# EAGLE design MIDI_CV_0.222 (EAGLE 6.1)
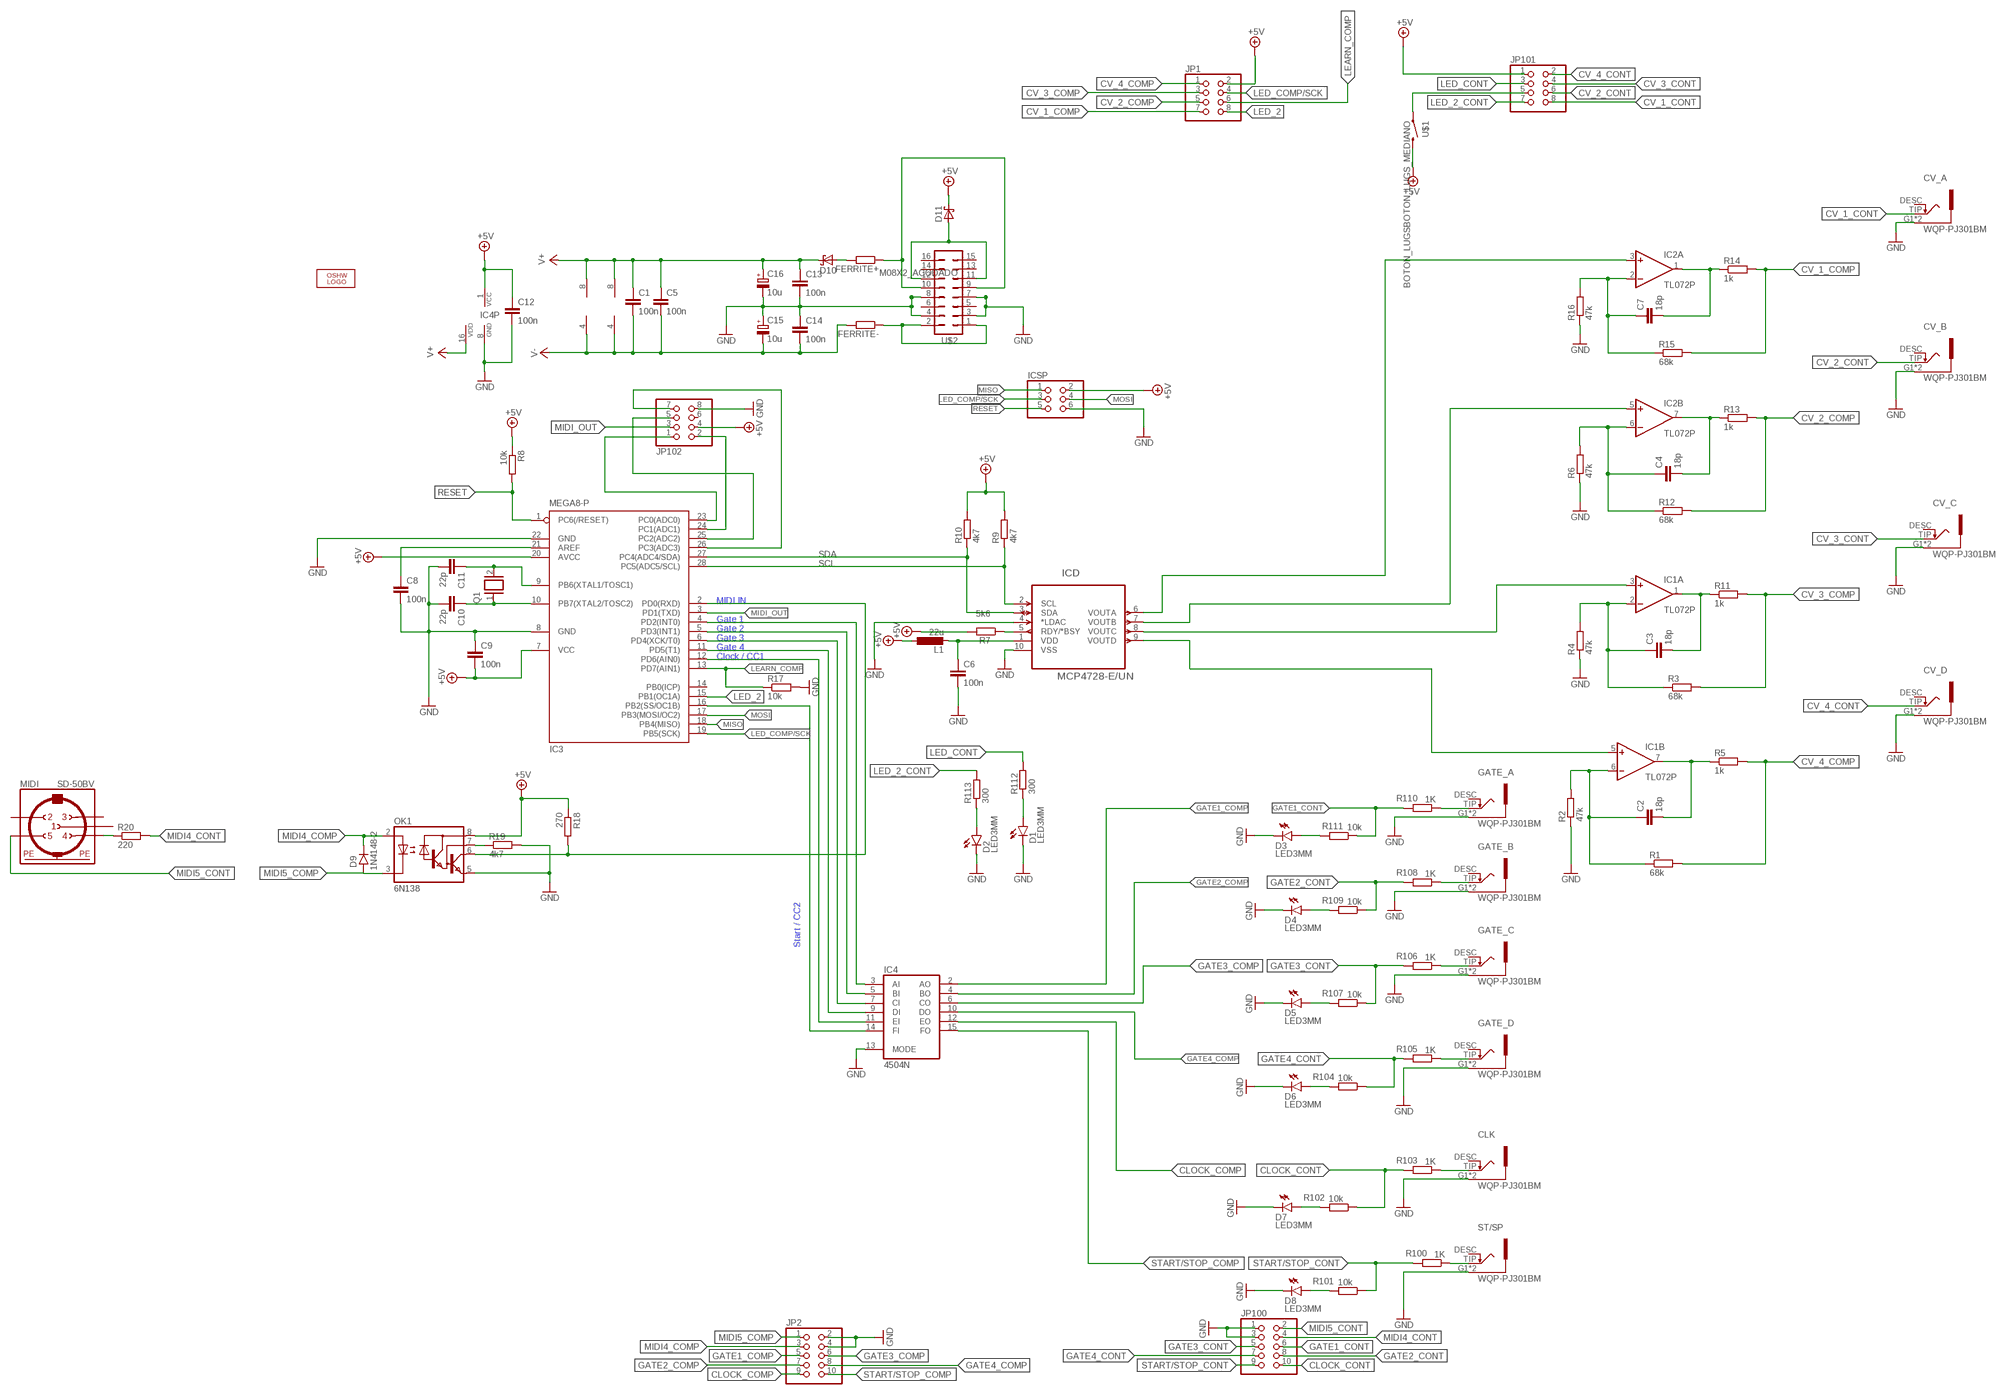
[diagram p0: schematic, sheet 1]

## Parts
$1_35_$  OSHW_LOGO_FILLX0200-NT  [OSHW_FILLX200_NOTEXT]
C1  100n  C-EU050-025X075  [C050-025X075]
C2  18p  C-EU050-025X075  [C050-025X075]
C3  18p  C-EU050-025X075  [C050-025X075]
C4  18p  C-EU050-025X075  [C050-025X075]
C5  100n  C-EU050-025X075  [C050-025X075]
C6  100n  C-EU050-025X075  [C050-025X075]
C7  18p  C-EU050-025X075  [C050-025X075]
C8  100n  C-EU050-025X075  [C050-025X075]
C9  100n  C-EU050-025X075  [C050-025X075]
C10  22p  C-EU050-025X075  [C050-025X075]
C11  22p  C-EU050-025X075  [C050-025X075]
C12  100n  C-EU050-025X075  [C050-025X075]
C13  100n  C-EU050-025X075  [C050-025X075]
C14  100n  C-EU050-025X075  [C050-025X075]
C15  10u  CPOL-EUE2-4  [E2-4]
C16  10u  CPOL-EUE2-4  [E2-4]
CLK  WQP-PJ301BM  [WQP-PJ301BM]
CV_A  WQP-PJ301BM  [WQP-PJ301BM]
CV_B  WQP-PJ301BM  [WQP-PJ301BM]
CV_C  WQP-PJ301BM  [WQP-PJ301BM]
CV_D  WQP-PJ301BM  [WQP-PJ301BM]
D1  LED3MM  [LED3MM]
D2  LED3MM  [LED3MM]
D3  LED3MM  [LED3MM]
D4  LED3MM  [LED3MM]
D5  LED3MM  [LED3MM]
D6  LED3MM  [LED3MM]
D7  LED3MM  [LED3MM]
D8  LED3MM  [LED3MM]
D9  1N4148-2  [DO35-2]
D10  SCHOTTKY-DIODEDO35-7  [DO35-7]
D11  SCHOTTKY-DIODEDO35-7  [DO35-7]
FERRITE+  R-EU_0204/5  [0204/5]
FERRITE-  R-EU_0204/5  [0204/5]
GATE_A  WQP-PJ301BM  [WQP-PJ301BM]
GATE_B  WQP-PJ301BM  [WQP-PJ301BM]
GATE_C  WQP-PJ301BM  [WQP-PJ301BM]
GATE_D  WQP-PJ301BM  [WQP-PJ301BM]
IC1  TL072P  [DIL08]
IC2  TL072P  [DIL08]
IC3  MEGA8-P  [DIL28-3]
IC4  4504N  [DIL16]
ICD  MCP4728-E/UN  [SOP50P490X110-10N]
ICSP  PINHD-2X3  [2X03]
JP1  PINHD-2X4  [2X04]
JP2  PINHD-2X5  [2X05]
JP100  PINHD-2X5  [2X05]
JP101  PINHD-2X4  [2X04]
JP102  PINHD-2X4  [2X04]
L1  22u  L-EU0204/7  [0204/7]
MIDI  SD-50BV  [SD-50BV]
OK1  6N138  [DIL08]
Q1  XTAL/S  [QS]
R1  68k  R-EU_0204/5  [0204/5]
R2  47k  R-EU_0204/5  [0204/5]
R3  68k  R-EU_0204/5  [0204/5]
R4  47k  R-EU_0204/5  [0204/5]
R5  1k  R-EU_0204/5  [0204/5]
R6  47k  R-EU_0204/5  [0204/5]
R7  5k6  R-EU_0204/5  [0204/5]
R8  10k  R-EU_0204/5  [0204/5]
R9  4k7  R-EU_0204/5  [0204/5]
R10  4k7  R-EU_0204/5  [0204/5]
R11  1k  R-EU_0204/5  [0204/5]
R12  68k  R-EU_0204/5  [0204/5]
R13  1k  R-EU_0204/5  [0204/5]
R14  1k  R-EU_0204/5  [0204/5]
R15  68k  R-EU_0204/5  [0204/5]
R16  47k  R-EU_0204/5  [0204/5]
R17  10k  R-EU_0204/5  [0204/5]
R18  270  R-EU_0204/5  [0204/5]
R19  4k7  R-EU_0204/5  [0204/5]
R20  220  R-EU_0204/5  [0204/5]
R100  1K  R-EU_0204/5  [0204/5]
R101  10k  R-EU_0204/5  [0204/5]
R102  10k  R-EU_0204/5  [0204/5]
R103  1K  R-EU_0204/5  [0204/5]
R104  10k  R-EU_0204/5  [0204/5]
R105  1K  R-EU_0204/5  [0204/5]
R106  1K  R-EU_0204/5  [0204/5]
R107  10k  R-EU_0204/5  [0204/5]
R108  1K  R-EU_0204/5  [0204/5]
R109  10k  R-EU_0204/5  [0204/5]
R110  1K  R-EU_0204/5  [0204/5]
R111  10k  R-EU_0204/5  [0204/5]
R112  300  R-EU_0204/5  [0204/5]
R113  300  R-EU_0204/5  [0204/5]
ST/SP  WQP-PJ301BM  [WQP-PJ301BM]
U$1  BOTON_LUGSBOTON_LUGS_MEDIANO  [BOTON_LUGS_MEDIANO]
U$2  M08X2_ACODADO  [2X8-POWER-ACODADO]

## Nets
+5V: C9.2 C12.1 D11.C IC3.7(VCC) IC3.20(AVCC) IC4.1(VCC) ICSP.2 JP1.2 JP101.1 JP102.4 L1.1 OK1.8(VCC) R7.2 R8.1 R9.2 R10.2 R18.1 U$1.P$2
A: IC2.3(A:+IN) ICD.6(VOUTA)
B: IC2.5(B:+IN) ICD.7(VOUTB)
C: IC1.3(A:+IN) ICD.8(VOUTC)
CLOCK_COMP: IC4.12(EO) JP2.9
CLOCK_CONT: JP100.10 R102.1 R103.2
CV_1_COMP: JP1.7 R14.2 R15.2
CV_1_CONT: CV_A.TIP JP101.8
CV_2_COMP: JP1.5 R12.2 R13.2
CV_2_CONT: CV_B.TIP JP101.6
CV_3_COMP: JP1.3 R3.2 R11.2
CV_3_CONT: CV_C.TIP JP101.4
CV_4_COMP: JP1.1 R1.2 R5.2
CV_4_CONT: CV_D.TIP JP101.2
D: IC1.5(B:+IN) ICD.9(VOUTD)
DAC_A_FEEDBACK_T: C7.2 IC2.1(A:OUT) R14.1
GATE1_COMP: IC4.2(AO) JP2.5
GATE1_CONT: JP100.6 R110.2 R111.1
GATE2_COMP: IC4.4(BO) JP2.7
GATE2_CONT: JP100.8 R108.2 R109.1
GATE3_COMP: IC4.6(CO) JP2.6
GATE3_CONT: JP100.5 R106.2 R107.1
GATE4_COMP: IC4.10(DO) JP2.8
GATE4_CONT: JP100.7 R104.1 R105.2
GND: C6.2 C8.2 C9.1 C10.2 C11.2 C12.2 C13.2 C14.1 C15.+ C16.- CLK.G1(SLEVE) CLK.G2(SLEVE) CV_A.G1(SLEVE) CV_A.G2(SLEVE) CV_B.G1(SLEVE) CV_B.G2(SLEVE) CV_C.G1(SLEVE) CV_C.G2(SLEVE) CV_D.G1(SLEVE) CV_D.G2(SLEVE) D1.K(C) D2.K(C) D3.K(C) D4.K(C) D5.K(C) D6.K(C) D7.K(C) D8.K(C) GATE_A.G1(SLEVE) GATE_A.G2(SLEVE) GATE_B.G1(SLEVE) GATE_B.G2(SLEVE) GATE_C.G1(SLEVE) GATE_C.G2(SLEVE) GATE_D.G1(SLEVE) GATE_D.G2(SLEVE) IC3.8(GND) IC3.22(GND) IC4.8(GND) IC4.13(MODE) ICD.4(*LDAC) ICD.10(VSS) ICSP.6 JP2.2 JP2.4 JP100.1 JP100.3 JP102.8 OK1.5(GND) R2.1 R4.1 R6.1 R16.1 R17.2 R19.2 ST/SP.G1(SLEVE) ST/SP.G2(SLEVE) U$2.3 U$2.4 U$2.7 U$2.8
LEARN_COMP: IC3.13(PD7(AIN1)) JP1.6 R17.1
LED_2: IC3.15(PB1(OC1A)) JP1.8
LED_2_CONT: JP101.7 R113.2
LED_COMP/SCK: IC3.19(PB5(SCK)) ICSP.3 JP1.4
LED_CONT: JP101.3 R112.2
MIDI4_COMP: D9.C JP2.3 OK1.2(A)
MIDI4_CONT: JP100.4 R20.2
MIDI5_COMP: D9.A JP2.1 OK1.3(C)
MIDI5_CONT: JP100.2 MIDI.5
MIDI_OUT: IC3.3(PD1(TXD)) JP102.3
MISO: IC3.18(PB4(MISO)) ICSP.1
MOSI: IC3.17(PB3(MOSI/OC2)) ICSP.4
N$1: D7.A R102.2
N$2: C10.1 IC3.10(PB7(XTAL2/TOSC2)) Q1.1
N$3: FERRITE-.1 U$2.1 U$2.2
N$4: IC3.23(PC0(ADC0)) JP102.1
N$5: C4.2 IC2.7(B:OUT) R13.1
N$6: C2.1 IC1.6(B:-IN) R1.1 R2.2
N$7: D1.A R112.1
N$8: JP101.5 U$1.P$1
N$9: IC3.16(PB2(SS/OC1B)) IC4.14(FI)
N$10: C3.2 IC1.1(A:OUT) R11.1
N$11: C7.1 IC2.2(A:-IN) R15.1 R16.2
N$12: IC3.24(PC1(ADC1)) JP102.2
N$13: R100.1 ST/SP.TIP
N$14: IC3.25(PC2(ADC2)) JP102.5
N$15: C3.1 IC1.2(A:-IN) R3.1 R4.2
N$16: CLK.TIP R103.1
N$17: GATE_D.TIP R105.1
N$18: ICD.5(RDY/*BSY) R7.1
N$19: IC3.5(PD3(INT1)) IC4.5(BI)
N$20: IC3.26(PC3(ADC3)) JP102.7
N$21: C2.2 IC1.7(B:OUT) R5.1
N$23: D11.A U$2.11 U$2.12
N$24: IC3.11(PD5(T1)) IC4.9(DI)
N$25: D10.A FERRITE+.2
N$26: D2.A R113.1
N$27: GATE_A.TIP R110.1
N$28: C6.1 ICD.1(VDD) L1.2
N$29: C11.1 IC3.9(PB6(XTAL1/TOSC1)) Q1.2
N$30: IC3.12(PD6(AIN0)) IC4.11(EI)
N$31: FERRITE+.1 U$2.9 U$2.10
N$32: D3.A R111.2
N$33: D8.A R101.2
N$34: GATE_B.TIP R108.1
N$35: IC3.4(PD2(INT0)) IC4.3(AI)
N$36: GATE_C.TIP R106.1
N$37: D4.A R109.2
N$38: IC3.6(PD4(XCK/T0)) IC4.7(CI)
N$39: MIDI.4 R20.1
N$41: C8.1 IC3.21(AREF)
N$42: D5.A R107.2
N$44: D6.A R104.2
N$46: OK1.7(VB) R19.1
N$56: IC3.2(PD0(RXD)) OK1.6(VO) R18.2
N$60: C4.1 IC2.6(B:-IN) R6.2 R12.1
RESET: IC3.1(PC6(/RESET)) ICSP.5 R8.2
SCL_B: IC3.28(PC5(ADC5/SCL)) ICD.2(SCL) R9.1
SDA_T: IC3.27(PC4(ADC4/SDA)) ICD.3(SDA) R10.1
START/STOP_COMP: IC4.15(FO) JP2.10
START/STOP_CONT: JP100.9 R100.2 R101.1
V+: C1.1 C5.1 C13.1 C16.+ D10.C IC1.8(P:V+) IC2.8(P:V+) IC4.16(VDD)
V-: C1.2 C5.2 C14.2 C15.- FERRITE-.2 IC1.4(P:V-) IC2.4(P:V-)
Unconnected: CLK.DESC(SWITCH) CV_A.DESC(SWITCH) CV_B.DESC(SWITCH) CV_C.DESC(SWITCH) CV_D.DESC(SWITCH) GATE_A.DESC(SWITCH) GATE_B.DESC(SWITCH) GATE_C.DESC(SWITCH) GATE_D.DESC(SWITCH) IC3.14(PB0(ICP)) JP102.6 MIDI.1 MIDI.2 MIDI.3 ST/SP.DESC(SWITCH) U$2.5 U$2.6 U$2.13 U$2.14 U$2.15 U$2.16

## Notes on the sheet
- SDA
- SCL
- MIDI IN
- Gate 1
- Gate 2
- Gate 3
- Gate 4
- Clock / CC1
- Start / CC2

## Library data of the parts
$1_35_$ = ohw-logo:OSHW_LOGO_FILL
C1-C14 = rcl:C-EU: CAPACITOR, European symbol
C15 C16 = rcl:CPOL-EU: POLARIZED CAPACITOR, European symbol
CLK CV_A CV_B CV_C CV_D GATE_A GATE_B GATE_C GATE_D ST/SP = minijack_3_5_quingpu:WQP-PJ301BM
D1-D8 = gm-diodes:LED
D9 = gm-diodes:1N4148: Fast Switching Diode DO-35 glass case a.k.a. 1N914
D10 D11 = diode:SCHOTTKY-DIODE: Schottky Diode
FERRITE+ FERRITE- R1-R20 R100-R113 = rcl:R-EU_: RESISTOR, European symbol
IC1 IC2 = linear:TL072: OP AMP
IC3 = atmel:MEGA8-P: MICROCONTROLLER 8 Kbytes FLASH, 1 kbytes SRAM, 512 bytes EEPROM, USART, 4-channel 10 bit ADC, 2-channel 8 bit ADC Pin compatible with Atmega48, ATMega88, ATMega168 Source: avr.lbr
IC4 = 45xx:4504: TTL or CMOS to CMOS hex LEVEL SHIFTER
ICD = MCP4728:MCP4728-E/UN: IC, DAC, 12BIT, QUAD; MPN: MCP4728-E/UN; OC_FARNELL: 1800217; OC_NEWARK: 08R1808; PACKAGE: MSOP-10; SUPPLIER: MICROCHIP
ICSP = pinhead:PINHD-2X3: PIN HEADER
JP1 JP101 JP102 = pinhead:PINHD-2X4: PIN HEADER
JP2 JP100 = pinhead:PINHD-2X5: PIN HEADER
L1 = rcl:L-EU: INDUCTOR, European symbol
MIDI = con-MIDI_PCB:SD-50BV
OK1 = optocoupler:6N138: MOTOROLA OPTO COUPLER
Q1 = special:XTAL/S: CRYSTAL
U$1 = boton_lugs:BOTON_LUGS
U$2 = SparkFun:M08X2_ACODADO

## Board
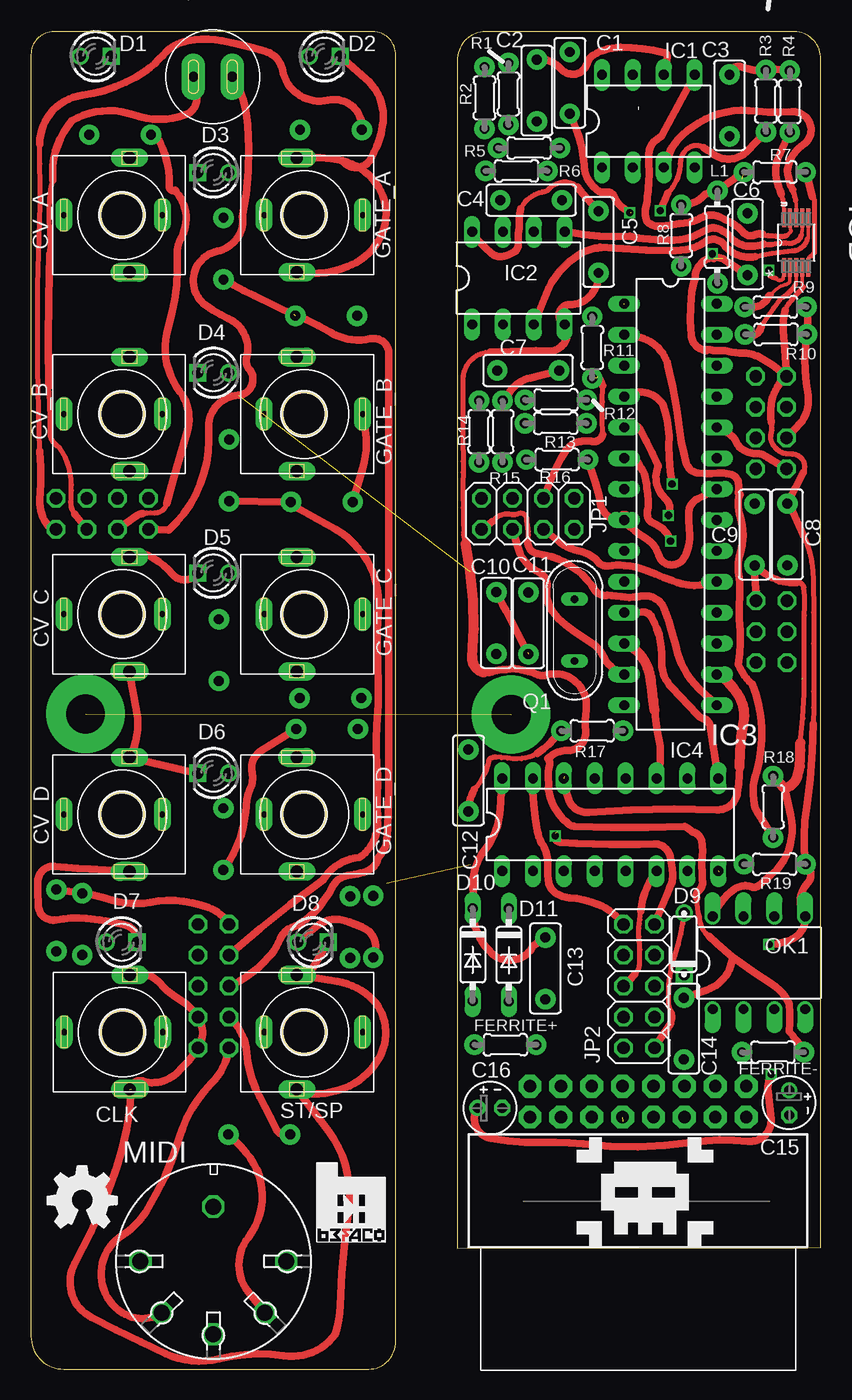
[diagram p1: board, top side]
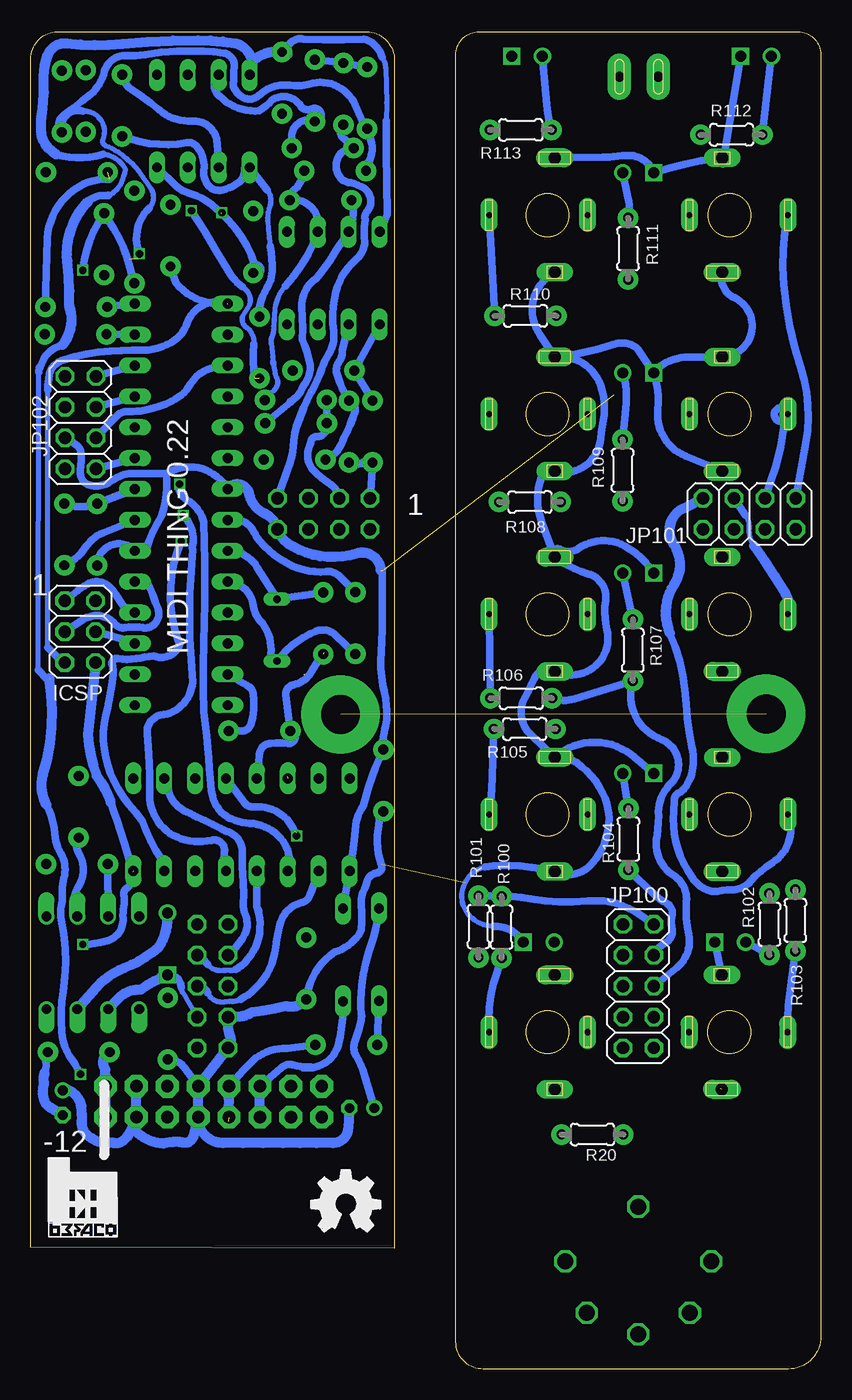
[diagram p2: board, bottom side, seen from below]

Size 64.95 x 110 mm. Coordinates in mm from the lower left corner, seen from the top.
Outline: 0,108.12 0,2.68 arc90 2.68,0 27.76,0 arc90 30,2.24 30,108.11 arc90 28.11,110 1.88,110 arc90 0,108.12
Outline: 35.05,9.95 64.95,10 64.95,107.77 arc90 62.77,110 37.36,110 arc90 35.05,107.64 35.05,9.95
Copper layers (1*16): Top 0.035mm / dielectric 1.5mm / Bottom 0.035mm
Design rules: minimum track width 6mil, minimum drill 12mil, track to track 6mil, track to pad 6mil, pad to pad 6mil, via to via 6mil, smd to smd 0mil, copper to edge 10mil, drill to drill 10mil, minimum pad ring 10mil, minimum via ring 6mil, stop-mask expansion 2mil, vias tented up to drill 100mil, thermal gap 10mil

### Footprints (pad centres in the part's own frame; a part is rotated, then mirrored left to right if it is on the bottom)
C050-025X075 = drill 0.813 pad 1.676: 1 -2.54,0; 2 2.54,0
E2-4 = drill 0.813 pad 1.27: + -1.016,0 | drill 0.813 pad 1.27 octagon: - 1.016,0
WQP-PJ301BM = drill 0.5 pad 1.4 long: DESC 0,-3.3; TIP 0,4.8 | drill 1 pad 1.2 long: G1 4.7,-0.6 | drill 1 pad 1.55 long: G2 -4.7,-0.6
LED3MM = drill 0.9: A -1.27,0 | drill 0.9 square: K 1.27,0
DO35-2 = drill 0.9: A 2.54,0 | drill 0.9 square: C -2.54,0
DO35-7 = drill 0.813 long: A 3.81,0; C -3.81,0
0204/5 = drill 0.813 pad 1.676: 1 -2.54,0; 2 2.54,0
DIL08 = drill 0.813 long: 1 -3.81,-3.81; 2 -1.27,-3.81; 3 1.27,-3.81; 4 3.81,-3.81; 5 3.81,3.81; 6 1.27,3.81; 7 -1.27,3.81; 8 -3.81,3.81
DIL28-3 = drill 0.813 long: 1 -16.51,-3.81; 2 -13.97,-3.81; 3 -11.43,-3.81; 4 -8.89,-3.81; 5 -6.35,-3.81; 6 -3.81,-3.81; 7 -1.27,-3.81; 8 1.27,-3.81; 9 3.81,-3.81; 10 6.35,-3.81; 11 8.89,-3.81; 12 11.43,-3.81; 13 13.97,-3.81; 14 16.51,-3.81; 15 16.51,3.81; 16 13.97,3.81; 17 11.43,3.81; 18 8.89,3.81; 19 6.35,3.81; 20 3.81,3.81; 21 1.27,3.81; 22 -1.27,3.81; 23 -3.81,3.81; 24 -6.35,3.81; 25 -8.89,3.81; 26 -11.43,3.81; 27 -13.97,3.81; 28 -16.51,3.81
DIL16 = drill 0.813 long: 1 -8.89,-3.81; 2 -6.35,-3.81; 3 -3.81,-3.81; 4 -1.27,-3.81; 5 1.27,-3.81; 6 3.81,-3.81; 7 6.35,-3.81; 8 8.89,-3.81; 9 8.89,3.81; 10 6.35,3.81; 11 3.81,3.81; 12 1.27,3.81; 13 -1.27,3.81; 14 -3.81,3.81; 15 -6.35,3.81; 16 -8.89,3.81
SOP50P490X110-10N = smd 1.524 x 0.33: 1 -2.032,0.991; 2 -2.032,0.508; 3 -2.032,0; 4 -2.032,-0.508; 5 -2.032,-0.991; 6 2.032,-0.991; 7 2.032,-0.508; 8 2.032,0; 9 2.032,0.508; 10 2.032,0.991
2X03 = drill 1.016 octagon: 1 -2.54,-1.27; 2 -2.54,1.27; 3 0,-1.27; 4 0,1.27; 5 2.54,-1.27; 6 2.54,1.27
2X04 = drill 1.016 octagon: 1 -3.81,-1.27; 2 -3.81,1.27; 3 -1.27,-1.27; 4 -1.27,1.27; 5 1.27,-1.27; 6 1.27,1.27; 7 3.81,-1.27; 8 3.81,1.27
2X05 = drill 1.016 octagon: 1 -5.08,-1.27; 2 -5.08,1.27; 3 -2.54,-1.27; 4 -2.54,1.27; 5 0,-1.27; 6 0,1.27; 7 2.54,-1.27; 8 2.54,1.27; 9 5.08,-1.27; 10 5.08,1.27
0204/7 = drill 0.813 pad 1.676: 1 -3.81,0; 2 3.81,0
SD-50BV = drill 1.321 octagon: 1 6,0; 2 0,-6; 3 -6,0; 4 4.24,-4.24; 5 -4.24,-4.24; PE 0,4.5
DIL08' = drill 0.813 offset: 1 -3.81,-3.81; 2 -1.27,-3.81; 3 1.27,-3.81; 4 3.81,-3.81; 5 3.81,3.81; 6 1.27,3.81; 7 -1.27,3.81; 8 -3.81,3.81
QS = drill 0.61 long: 1 -2.54,0; 2 2.54,0
BOTON_LUGS_MEDIANO = drill 0.8 pad 1.93 long: P$1 -1.6,0; P$2 1.6,0
2X8-POWER-ACODADO = drill 1.016 pad 1.88 octagon: 1 -1.27,7.62; 2 1.27,7.62; 3 -1.27,5.08; 4 1.27,5.08; 5 -1.27,2.54; 6 1.27,2.54; 7 -1.27,0; 8 1.27,0; 9 -1.27,-2.54; 10 1.27,-2.54; 11 -1.27,-5.08; 12 1.27,-5.08; 13 -1.27,-7.62; 14 1.27,-7.62; 15 -1.27,-10.16; 16 1.27,-10.16

### Placement (x,y rotation side)
$1_35_$  41.89,11.3 0 bottom
C1  44.3,105.8 270 top
C2  41.6,105.17 270 top
C3  57.44,103.95 270 top
C4  41.13,96.15 180 top
C5  46.67,92.71 270 top
C6  58.92,92.53 270 top
C7  40.89,82.14 180 top
C8  62.2,68.65 90 top
C9  59.5,68.64 270 top
C10  38.27,61.37 90 top
C11  40.91,61.35 270 top
C12  35.97,48.42 270 top
C13  42.3,32.96 270 top
C14  53.69,28.01 90 top
C15  62.34,21.91 270 top
C16  37.74,21.47 0 top
CLK  7.53,27.72 90 top
CV_A  7.5,94.93 90 top
CV_B  7.5,78.56 90 top
CV_C  7.5,62.09 90 top
CV_D  7.5,45.62 90 top
D1  5.32,108 0 top
D2  24.15,108 0 top
D3  15,98.41 180 top
D4  15,81.94 180 top
D5  15,65.48 180 top
D6  15,49.01 180 top
D7  7.45,35.12 0 top
D8  23.19,35.12 0 top
D9  53.71,34.97 90 top
D10  36.33,34.09 270 top
D11  39.29,34.07 270 top
FERRITE+  39.01,26.68 180 top
FERRITE-  61.01,26.07 0 top
GATE_A  22.47,94.93 270 top
GATE_B  22.47,78.56 270 top
GATE_C  22.47,62.09 270 top
GATE_D  22.47,45.62 270 top
IC1  50.77,102.65 0 top
IC2  40.08,89.74 0 top
IC3  52.58,71.12 270 top
IC4  47.63,44.78 0 top
ICD  62.91,92.66 90 top
ICSP  60.89,60.66 270 bottom
JP1  40.86,70.35 180 top
JP2  50,31.5 90 top
JP100  15,31.5 90 bottom
JP101  5.86,70.35 0 bottom
JP102  60.86,77.86 90 bottom
L1  56.44,93.12 270 top
LOGO1  OSHW_LOGO_FILLX0200-NT  [OSHW_FILLX200_NOTEXT]  1.38,11.64 0 top
MIDI  15,8.87 0 top
OK1  6N138  [DIL08']  59.86,33.42 0 top
Q1  44.71,60.78 90 top
R1  39.26,104.89 270 top
R2  37.3,104.56 90 top
R3  60.43,104.31 270 top
R4  62.39,104.27 90 top
R5  40.95,100.44 180 top
R6  39.93,98.56 0 top
R7  61.17,98.46 180 top
R8  53.47,93.24 270 top
R9  61.22,87.38 0 top
R10  61.27,85.12 0 top
R11  46.15,84.03 270 top
R12  43.16,79.72 180 top
R13  43.15,77.8 180 top
R14  36.85,77.12 270 top
R15  38.79,77.11 270 top
R16  43.26,74.81 180 top
R17  46.15,52.5 180 top
R18  61.03,46.25 270 top
R19  61.16,41.54 0 top
R20  18.78,19.3 180 bottom
R100  26.24,36.35 90 bottom
R101  28.14,36.39 270 bottom
R102  4.22,36.6 270 bottom
R103  2.09,36.91 90 bottom
R104  15.82,43.6 90 bottom
R105  24.34,52.66 0 bottom
R106  24.63,55.19 0 bottom
R107  15.45,59.14 90 bottom
R108  23.92,71.33 0 bottom
R109  16.29,73.93 90 bottom
R110  24.28,86.64 0 bottom
R111  15.83,92.17 90 bottom
R112  7.33,101.53 180 bottom
R113  24.67,101.93 180 bottom
ST/SP  22.47,27.72 270 top
U$1  14.96,106.31 0 top
U$2  51.19,21.99 270 top
U$3  LOGOBEFACOCONLETRAS  [LOGOBEFACOCONLETRAS_2]  26.09,13.12 0 top
U$4  [CALAVERA]  44.86,10.02 0 top
U$100  LOGOBEFACOCONLETRAS  [LOGOBEFACOCONLETRAS_2]  60.92,13.54 0 bottom

### Tracks (layer width: path | path; a pad name or v marks a point on that pad's centre or on a via)
+5V  (3 unrouted)
  Top 0.406: 63.28,51.53 arc9 63.57,57.59 arc0 63.59,62 arc11 63.56,64.29 arc84 62.96,64.72
  Top 0.61: 62.96,64.72 arc-28 61.31,64.93 arc-23 C9.2 arc8 59.7,63.23 arc-146 ICSP.2 | JP102.4 arc6 63.26,77.8 arc49 63.89,80.13 arc-19 R10.2 arc19 R9.2 | R7.2 L1.1 arc8 55.43,96.64 arc-56 R8.1 | JP101.1 11.35,69 arc51 14.61,77.31 arc-90 17.03,80.1 arc127 17.94,82.26 arc-56 17.73,83.22 arc81 16.24,86.4 arc-12 14.37,87.5 arc-132 15.32,91.96 arc51 17.16,93.37 arc34 17.41,94.82 arc-51 17.39,94.75 arc16 17.84,102.32 arc27 16.57,106.32 arc231 U$1.P$2 | 61.99,47.78 62.48,45.52 arc-54 61.33,41.07 arc3 59.83,39.77 arc-63 59.27,39.66 arc55 57.87,39.5 arc34 56.11,37.29 arc-100 56.05,37.27 arc230 OK1.8
  Top 0.813: R18.1 61.99,47.78 arc65 63.05,48.88 arc-4 63.22,49.6 arc1 63.28,51.53
  Bottom 0.61: IC3.7 arc-93 53.82,73.65 | 53.82,73.65 arc26 54.2,70.22 arc-13 55.47,67.43 arc94 IC3.20 arc-138 C9.2 | 53.82,73.65 56.48,73.65 arc-35 57.88,73.31 arc2 58.6,72.89 arc50 60.25,72.76 arc48 60.8,73.31 arc27 60.89,73.95 arc-3 60.8,75.09 arc-73 61.57,76.23 arc24 JP102.4 | R9.2 63.6,93 arc62 60.55,97.49 arc28 58.47,97.87 | C12.1 arc-11 37.61,46.33 arc-26 38.25,44.76 arc5 IC4.1 D11.C | 36.06,50.77 arc16 35.84,52.61 arc-20 35.71,54.58 arc-11 36.01,56.28 arc18 36.14,58.98 arc-5 36.07,64.43 arc5 36.05,65.66
  Bottom 0.813: C12.1 arc-29 36.06,50.77 | 36.16,65.65 arc-106 38.15,67.09 arc47 43.44,67.68 arc44 JP1.2 arc-51 45.6,70.31 arc55 47,72 arc-131 IC3.7
A
  Top 0.305: ICD.6 63.89,93 63.85,93
  Top 0.406: 59.58,91.52 arc-9 61.61,91.86 arc-5 62.58,91.99 arc78 63.85,93
  Top 0.61: IC2.3 42.38,88.43 arc-45 45.6,91.94 arc-24 46.87,92.24 arc12 46.79,92.28 arc3 52.5,91.99 arc16 54.33,92.2 arc22 55.38,92.7 arc-89 56.99,92.49 arc66 59.58,91.52
B
  Top 0.305: ICD.7 63.43,93.85 arc-10 63.34,93.3
  Top 0.406: 63.34,93.3 arc-49 63.01,92.79 arc-11 62.62,92.62 arc-26 62.33,92.58 arc18 61.18,92.54 arc-26 60.25,92.54
  Top 0.61: IC2.5 44.25,93.51 arc15 49.24,93.17 arc9 50.35,93 arc-1 51.91,92.87 arc18 53.86,93 arc15 54.92,93.38 arc2 55.64,93.76 arc-43 56.32,93.85 arc-35 57.54,93.09 arc45 58.98,92.37 arc17 60.04,92.45 arc-26 60.25,92.54
C
  Top 0.305: 62.88,96.09 arc-20 62.92,95.58 arc9 ICD.8
  Top 0.406: 62.62,97.02 arc-1 62.88,96.09
  Top 0.61: IC1.3 52.63,100.37 arc-23 54.37,102.15 arc-44 59.66,103.46 arc11 62.54,103.42 arc-148 63.56,100.75 arc48 62.2,98.63 arc21 62.62,97.02
CLOCK_COMP  (via drill 0.6)  (1 unrouted)
  Top 0.61: JP2.9 52.3,39.09 arc-3 52.59,39.73 arc30 52.76,40.68 arc7 52.55,42.17 arc80 51.24,43.19 arc-3 47.6,43.16 arc-3 43.53,43.34 arc-95 v43.1,43.87
  Bottom 0.61: IC4.12 47.41,46.61 arc-58 46.56,46.23 arc73 43.26,44.19 | v43.1,43.87 arc17 43.1,44.11
CLOCK_CONT
  Top 0.61: R103.2 R102.1 arc-9 6.73,38.57 arc28 9.8,38.39 arc-31 14.59,37.98 arc-38 JP100.10
CV_1_COMP
  Bottom 0.61: JP1.7 R14.2 arc-150 37.18,74.92 arc76 R15.2
CV_1_CONT
  Bottom 0.61: JP101.8 1.22,76.18 arc-28 1.65,82.36 arc13 3.06,89.21 arc17 CV_A.TIP
CV_2_COMP
  Bottom 0.61: R12.2 R13.2 arc97 41.37,76.7 arc-82 41.88,76.4 arc0 42.09,75.77 arc-69 41.5,73.69 arc-4 40.18,72.68 arc41 JP1.5
CV_2_CONT
  Bottom 0.61: JP101.6 3.67,74.34 arc-12 2.89,79 arc346 2.89,78.94 arc-315 CV_B.TIP
CV_3_COMP  (via drill 0.6)  (2 unrouted)
  Top 0.406: 47,76.87 arc-3 47,80.89 | 55.34,100.45 arc78 53.9,100.33 arc51 53.39,98.97 arc-36 52.38,96.73
  Top 0.61: JP1.3 42.89,73.52 arc-10 44.04,75.6 arc-55 45.35,76.32 arc-3 46.07,76.32 arc93 47,76.87 | 47,80.89 arc25 46.58,81.65 | R3.2 58.86,100.16 arc-81 56.15,99.9 arc1 55.34,100.45 | 52.38,96.73 arc0 v51.74,95.29
  Bottom 0.406: 47.55,89.02 arc74 46.96,87.58 arc1 47.55,86.57 arc-76 47.25,85.72 arc60 46.62,84.32
  Bottom 0.61: v51.74,95.29 arc2 48.69,90.29 arc-25 47.55,89.02 | 46.62,84.32 arc-15 46.53,81.53
CV_3_CONT
  Bottom 0.406: 6.19,70.26 arc40 5.9,69.17 arc-41 5.49,67.7
  Bottom 0.61: JP101.4 6.19,70.26
  Bottom 0.813: 5.49,67.7 arc5 2.98,63.92 arc44 CV_C.TIP
CV_4_COMP  (1 unrouted)
  Bottom 0.61: JP1.1 43.61,74.62 arc-13 43.39,75.82 arc15 42.94,78.03 arc7 42.26,79.63 41.87,80.41 | 38.4,100.5 arc-140 39.25,97.74 arc-101 39.25,97.79 arc-30 38.66,97.57 arc8 37.77,97.28 arc31 37.3,96.9 arc87 37.35,95.2 arc-40 37.47,94.57 arc-8 37.52,92.58 arc51 38.24,91.27 arc-38 39.97,88.13 arc-17 40.06,85.34 arc41 40.46,83.48 arc-15 41.02,82.28 arc11 41.61,80.89 arc-4 41.86,80.4 | 38.4,100.5 arc178 R5.2 | 38.4,100.5 39.34,101.34 arc91 R1.2
CV_4_CONT
  Bottom 0.61: 12.4,60.51 arc21 11.07,54.69 arc-10 10.61,51.21 arc19 10.51,49.45 arc32 11.21,47.77 arc25 11.7,47.38 arc-63 12.05,46.82 arc4 12.09,45.85 arc-27 11.54,42.23 arc-12 10.58,40.44 arc-33 9.33,39.4 arc-34 8.5,39.31 arc10 7.29,39.42 arc-49 5.78,40.12 arc17 3.99,41.65 arc-80 CV_D.TIP
  Bottom 0.813: JP101.2 11.36,70.76 arc-98 12.1,67.86 arc67 12.06,64.55 arc-56 12.4,60.51
D
  Top 0.305: 62.16,93.26 arc37 62.37,93.47 arc37 62.5,93.59 arc-20 ICD.9
  Top 0.406: 60.17,93.34 arc17 61.02,93.21 arc-8 61.65,93.17 arc34 62.16,93.26
  Top 0.61: IC1.5 51.87,101.47 arc-19 51.32,101.05 arc46 50.81,99.99 arc5 50.81,99.01 arc-5 50.81,97.79 arc36 50.81,97.4 arc51 50.77,97.32 arc-6 50.73,96.69 arc2 50.64,95.84 arc45 50.64,94.44 arc60 51.83,94.02 arc1 54.07,94.31 arc18 55.09,94.7 arc-53 56.61,94.78 arc-9 57.97,94.06 arc-20 58.52,93.55 arc78 59.53,93.3 arc-42 60.17,93.34
DAC_A_FEEDBACK_T
  Bottom 0.61: IC2.1 C7.2 R14.1
GATE1_COMP
  Bottom 0.406: 47.7,30.41 arc30 48.42,30.23 arc-10 49.03,30.19 arc75 50.42,30.96
  Bottom 0.61: IC4.2 41.97,39.03 arc56 42.68,38.38 arc-62 44.48,36.55 arc-7 44.81,34.71 arc44 46.8,31.03 arc11 47.7,30.41 | 50.42,30.96 arc-64 51.24,31.53 arc-96 JP2.5
GATE1_CONT  (1 unrouted)
  Top 0.61: 21.6,86.76 arc-11 24.6,85.3 arc44 27.9,84.75 arc-103 29.43,83.52 29.43,49.07 arc-2 29.34,44.47 arc-9 29.16,42.98 arc-12 28.52,42.01 arc-44 28.01,41.18 arc-19 26.88,40.74 arc24 25.25,40.28 arc27 24.56,39.2 arc-1 23.85,38.2 arc-18 22.65,37 arc-14 21.45,36.33 arc46 20.49,35.37 arc-19 19.57,33.89 arc-19 17.16,31.94 arc-6 JP100.6 | R110.2 18.36,88.29 arc-3 R111.1
GATE2_COMP
  Bottom 0.406: 48.09,32.89 arc38 48.56,32.79 arc-15 48.96,32.79 arc12 49.47,32.78 arc47 50.41,33.28
  Bottom 0.61: IC4.4 46.39,38.01 arc17 46.23,37.7 arc-27 46.31,37.86 arc67 47.66,33.15 arc2 48.09,32.89 | 50.41,33.28 arc-21 51.26,34.01 arc67 JP2.7
GATE2_CONT
  Top 0.61: R109.1 21.05,71.33 | 21.05,71.33 R108.2 | 21.05,71.33 25.02,69.08 arc-55 28.57,63.57 arc-10 28.57,62.1 arc8 28.51,58 arc-8 28.45,52.93 arc10 28.45,49.68 arc-8 28.48,47.29 arc8 28.49,45.92 arc-8 28.49,45.01 arc-29 28.51,44.65 arc-51 27.01,42.09 arc52 24.03,40.28 arc-23 23.92,40.16 arc5 16.33,34.12 arc-23 JP100.8
GATE3_COMP
  Top 0.406: 49.65,32.45 arc48 50.05,33.53 arc-8 50.05,34.17 arc11 50.02,35.21 arc-14 50.02,36.64 arc2 50.14,37.65
  Top 0.61: JP2.6 49.65,32.45 | 50.14,37.65 arc-32 IC4.6
GATE3_CONT
  Bottom 0.61: R106.2 arc-39 20.28,55.12 R107.1 arc-88 13.03,51.76 arc116 12.48,48.01 arc-47 13.34,45.54 arc7 13.46,43.88 arc-71 11.96,40.5 arc58 11.04,38.45 arc-17 10.86,35.76 arc64 11.82,33.04 JP100.5
GATE4_COMP
  Bottom 0.61: IC4.10 arc-90 IC4.10 arc0 53.56,47.36 arc-49 52.12,45.83 arc2 51.29,45.41 arc4 49.34,44.48 arc-13 48.82,44.22 arc63 47.61,42.94 arc15 47.56,42.25 arc-9 47.53,40.77 arc10 47.5,38.27 arc-23 47.26,37.19 arc44 47.34,35.78 arc20 48.8,34.02 arc89 48.89,34.02 arc258 JP2.8
GATE4_CONT
  Top 0.61: R105.2 18.9,50.83 arc71 18.18,49.09 arc-39 18.01,47.69 arc21 17.75,46.8 arc-3 17.58,45.35 arc-29 R104.1
  Bottom 0.61: R104.1 13.64,39.01 arc-15 12.68,38.32 arc77 12.24,37.29 arc-31 12.24,36.31 arc76 12.75,35.08 arc-35 JP100.7
GND  (via drill 0.6)  (5 unrouted)
  Top 0.305: ICD.4 arc-17 63.43,90.59 63.43,89.11 63.51,89.02 | 61.86,95.88 arc-1 61.9,95.37 arc-5 ICD.10
  Top 0.406: 63.51,73.74 arc115 62.62,75.26 arc-5 62.07,75.3 arc-40 61.31,75.68 arc-13 60.93,76.19 arc-44 60.85,76.78 arc23 60.89,77.89 | 61.69,96.64 arc-14 61.86,95.88 | 41.65,50.62 arc-28 39.62,50.19 arc5 38.25,50.34 arc34 38.05,50.31 arc58 37.63,50.06 arc-30 36.47,47.67 | 62.03,87.12 arc-22 62.5,87.88 arc0 62.88,88.3 arc-11 63.22,88.68 arc21 63.51,89.02 | 63.51,89.02 arc90 63.51,89.02 | 63.51,68.61 arc-24 64.34,64.86 arc-1 64.37,57.08 arc-1 64.34,53.07
  Top 0.61: C11.2 39.08,62.35 arc0 C10.2 | IC3.22 54.79,71.58 arc66 54.07,70.35 arc1 54.16,68.57 arc-34 53.69,66.71 arc-132 51.62,66.96 arc43 50.47,68.4 arc-18 48.61,69.92 arc-313 IC3.8 arc-93 46.83,71.2 arc10 46.41,72.97 R16.1 | C8.2 62.27,71.34 | 62.27,71.34 63.51,73.74 | 60.89,77.89 arc-22 60.93,79.71 arc-39 JP102.8 | JP102.8 61.9,84.91 arc-22 62.03,87.12 | C6.2 56.87,91.35 arc113 54.62,89.7 arc4 54.33,88.64 arc11 54.28,85.04 arc57 55,83.94 arc13 55.43,83.77 arc58 55.6,83.81 arc-67 55.85,83.86 arc32 56.44,83.77 arc-22 57.25,83.73 arc14 58.64,83.56 arc-26 59.75,83.31 arc-17 JP102.8 | R4.1 61.4,99.56 arc38 61.4,97.49 arc1 61.69,96.64 | v56.02,91.73 arc90 56.15,91.35 | R17.2 43.37,52.3 arc-17 41.65,50.62 | 36.47,47.67 arc30 C12.2 | D6.K CV_D.G1 arc39 8.7,54.02 CV_C.G2 | D5.K arc-105 11.61,65.42 arc24 9.66,66.9 arc55 CV_C.G1 | GATE_A.G2 arc-15 25.62,99.39 | 25.62,99.39 arc-45 28.6,97.21 arc-52 28.92,93.53 arc-49 26,90.67 arc-32 GATE_A.G1 | 62.27,71.34 63.51,68.61 | 64.34,53.07 arc-8 63.78,46.26 arc17 R19.2 arc-98 63.84,39.94 arc81 OK1.5 arc-67 62.6,35.37 arc-27 v60.69,34.93 | D2.K 27.53,106.16 arc-59 28.9,102.23 arc-19 27.94,99.53 arc-115 25.62,99.39 | CLK.G1 arc-68 10.62,31.72 arc20 12.15,30.45 arc-27 JP100.3 arc-67 JP100.1 arc-13 11.98,24.33 arc-61 9.17,23.7 arc105 8.26,23.06 arc-15 7.03,16.58 arc-10 3.61,8.68 arc91 4.96,4.28 arc3 11.07,1.28 arc38 15.48,0.85 arc-22 20.8,1.1 arc62 25.02,2.87 arc17 25.45,5.25 arc-7 26.12,13.08 arc45 24.47,19.57 ST/SP.G1 arc34 23.66,22.63 arc20 26.21,23.31 arc38 28.71,25.73 arc34 29.14,28.2 arc41 27.86,30.62 arc33 25.19,31.89 ST/SP.G2 arc81 23.06,32.81 D8.K
  Top 0.61: CV_D.G2 4.82,41.12 arc-2 1.97,41.36 arc95 0.57,40.12 arc3 0.57,39.32 arc0 0.6,38.12 arc99 2.07,36.95 arc-16 4.55,37.08 arc-9 7.72,36.55 arc-82 D7.K
  Bottom 0.406: 55.21,95.5 arc-74 55.09,97.11 arc-4 56.07,98.52 arc-20 57.76,100.1 arc-12 58.82,100.65 arc92 59.03,101.13 arc-118 60.68,103.46 | 26.83,36.43 arc75 29.42,38.27 arc43 29.24,39.99 arc54 27.57,41.32
  Bottom 0.61: 40.86,58.96 arc-8 41.83,57.43 arc49 43.36,56.29 arc-82 43.99,55.44 arc2 R17.2 arc169 43.78,51.46 arc-8 45.26,51.46 arc-82 46.15,50.57 arc4 IC4.13 | C10.2 39.59,65.23 arc-50 40.65,65.61 arc30 43.44,66.07 arc26 46.15,68.15 arc13 46.62,68.87 arc-78 IC3.8 | IC3.22 C9.1 arc43 C8.2 | R6.1 37.09,99.48 arc-40 36.97,100.96 | 36.97,100.96 arc-5 37.39,102.27 arc-34 R2.1 | 60.68,103.46 arc-124 R4.1 arc345 62.41,101.72 arc99 62.2,103.16 arc-4 60.04,104.86 arc-36 58.9,106.72 arc81 57.12,108.03 arc-14 55.55,108.12 arc11 51.57,108.41 arc9 49.07,108.24 arc82 48.23,107.19 arc1 48.31,105.62 arc-31 48.27,105.41 arc-30 47.59,104.65 arc-74 46.24,104.73 arc6 45.69,105.15 arc39 43.99,105.62 arc-3 42.94,105.58 arc-18 42.05,105.7 arc83 38.28,103.97 36.97,100.96 | 55.21,95.5 arc-68 v56.02,91.73 | U$2.3 56.4,20.85 | C12.2 arc-36 36.33,44.69 arc-33 36.12,41.51 arc101 36.53,40.8 arc-61 37.27,40.19 arc2 37.64,39.21 arc-28 37.79,38.12 arc12 37.79,36.23 arc29 37.98,35.72 arc39 39.97,34.32 arc-48 C13.2 | GATE_D.G2 arc37 20.08,49.88 arc34 17.73,46.92 arc35 17.54,44.08 arc25 18.73,41.66 arc76 GATE_D.G1 arc-12 25.67,41.44 arc-11 27.57,41.32 | D6.K 15.59,50.54 arc-79 GATE_D.G2 | GATE_D.G2 23.81,52.15 arc76 24.34,55.19 arc-4 23.53,56.85 arc92 GATE_C.G1 arc-130 17.59,60.85 arc22 17.69,63.19 arc-81 19.11,65.42 arc21 GATE_C.G2 | GATE_C.G2 arc172 21.48,67.43 arc-64 19.92,67.5 arc63 16.14,67.72 arc28 D5.K | GATE_C.G2 22.93,69.64 arc40 22.97,73.34 arc85 GATE_B.G1 arc-99 18.09,76.52 arc4 17.88,78.01 arc-29 18.09,80.89 arc-77 GATE_B.G2 | D4.K 14.86,83.65 arc-73 16.82,84.33 arc12 GATE_B.G2
  Bottom 0.61: D4.K arc48 11.17,83.23 CV_B.G1 arc-153 7.09,88.11 arc81 CV_A.G2 | GATE_B.G2 23.1,85.1 arc55 23.53,88.33 arc38 GATE_A.G1 | GATE_A.G2 17.93,99.67 arc-11 17.07,99.73 arc13 15.6,99.82 arc64 D3.K arc2 9.85,99.41 CV_A.G1 arc146 8.01,99.42 | CV_B.G2 11.11,75.11 arc74 13.4,78.88 arc-24 D4.K | U$2.7 52.36,24.83 arc-57 53.83,25.52 arc-313 C14.1 | 58.39,46.64 arc1 57.59,44.29 arc3 56.57,40.89 arc71 57.07,39.55 arc-67 57.29,39.01 arc23 57.29,38.08 arc-14 57.37,37.07 arc78 58.72,35.2 arc15 v60.69,34.93 | D1.K 8.01,99.42 | 8.01,99.42 8.05,99.12 | D8.K arc-60 26.83,36.43 | CLK.G1 D7.K
  Bottom 0.813: 51.19,20.81 U$2.8 arc-92 49.16,18.61 arc0 44.21,18.61 arc0 40.1,18.61 arc-86 38.87,19.75 C16.- | 51.19,20.81 U$2.7 49.6,25.32 arc1 JP2.2 arc-58 48.56,27.39 arc26 JP2.4 arc119 48.74,29.15 arc-57 46.76,29.37 arc-7 44.03,29.87 arc-65 C13.2 | U$2.3 U$2.4 arc-94 55.89,19.2 arc-35 54.03,18.56 arc24 52.46,18.65 arc-94 51.62,19.11 51.19,20.81 | ICSP.6 60.25,52.18 arc-18 59.53,48.8 arc17 58.39,46.64 | 56.4,20.85 arc37 57.12,19.03 arc75 58.35,18.65 arc-40 58.18,18.65 arc57 60.34,19.28 arc53 60.76,20.34 arc-13 60.8,21.61 arc-56 61.74,22.88 arc-44 C15.+
LEARN_COMP
  Top 0.61: JP1.6 40.06,67.55 arc50 41.75,65.56 arc-73 42.43,64.34 arc55 43.36,61.75 arc12 45.98,59.81 arc-33 47.04,58.66 arc46 IC3.13
  Bottom 0.61: IC3.13 47.17,56.25 arc54 46.66,55.49 arc9 46.62,54.26 arc17 46.87,52.99 arc70 47.59,52.48 arc5 48.65,52.52 arc-78 R17.1
LED_2
  Top 0.406: 40.86,68.06 arc19 40.82,69.5 arc-21 40.78,69.97 arc112 39.97,70.32 arc-33 39.38,70.32 arc62 37.95,69.71
  Top 0.61: IC3.15 54.92,55.99 arc-28 53.31,58.49 arc-5 53.01,59.51 arc7 52.08,62.52 arc81 50.18,63.57 arc-20 48.52,63.53 arc4 47.38,63.66 arc-56 46.44,63.97 arc52 41.62,67.07 arc-84 40.86,68.06 | 37.95,69.71 arc-13 JP1.8
LED_2_CONT
  Top 0.406: 0.72,75.53 arc-5 0.75,95.83 arc1 0.72,100.76
  Top 0.61: JP101.7 1.84,68.94 arc-51 0.71,71.49 arc11 0.72,75.53 | 0.72,100.76 arc-83 4.23,104.78 arc27 9.38,106.77 arc14 10.86,108.09 arc-38 12.9,109.27 arc-21 15.7,109.27 arc-6 19.27,108.4 arc-63 20.7,106.82 arc92 24.42,104.37 arc-110 27.22,101.82 arc-330 R113.2
LED_COMP/SCK
  Top 0.61: JP1.4 43.54,67.99 arc21 45.07,67.27 arc-40 46.58,66.45 arc64 47.47,66.07 arc-14 48.78,66.11 arc-17 50.73,65.65 arc0 52.72,64.84 arc42 IC3.19
  Bottom 0.61: ICSP.3 60.63,61.67 arc14 60.3,61.84 arc13 59.75,61.96 arc24 58.9,61.88 arc33 58.09,61.33 arc-62 57.16,60.99 arc22 55.76,60.99 arc-77 54.54,61.63 arc-43 54.49,62.52 arc-4 55.17,64.29 arc-92 IC3.19
LED_CONT
  Top 0.406: 9.19,70.38 arc-11 10.15,70.43 arc78 11.18,71.2
  Top 0.61: JP101.3 8.7,70.19 arc-27 9.19,70.38 | 11.18,71.2 arc-2 12.84,77.13 arc54 12.24,80.42 arc-54 11.29,85.66 arc19 12.03,91.57 arc-30 12.38,93.12 arc69 11.96,96.8 arc-88 11.92,96.89 arc126 11.85,96.95 arc-112 11.38,97.3 arc29 10.58,100.96 arc51 9.87,101.52 arc-189 R112.2
MIDI4_COMP
  Bottom 0.406: JP2.3 52.18,30.55 arc-7 52.47,30.99 arc39 52.59,31.38
  Bottom 0.61: 52.59,31.38 arc-97 D9.C
  Bottom 0.813: OK1.2 57.76,30.48 arc51 55.88,31.22 arc18 D9.C
MIDI4_CONT
  Top 0.61: JP100.4 arc-13 16.82,28.41 arc-34 17.75,26.03 arc24 18.82,22.38 arc-3 20.13,19.79 arc84 R20.2
MIDI5_COMP
  Top 0.406: 52.63,28.42 arc70 52.61,29.49 arc-41 52.44,30.31 arc-14 52.64,32.84 arc-1 52.63,33.26 arc18 D9.A
  Top 0.61: JP2.1 52.63,28.42
  Bottom 0.813: OK1.3 59.56,31.4 arc27 57.29,32.99 arc-19 54.46,34.67 arc-38 D9.A
MIDI5_CONT
  Top 0.61: MIDI.5 arc-65 7.52,4.63 arc-115 7.52,11 arc25 9.43,12.91 arc16 12.19,19.03 arc-29 14.82,23.48 arc37 JP100.2
MIDI_OUT
  Bottom 0.61: JP102.3 58.31,77.97 arc4 57.84,78.44 arc46 56.91,78.77 arc-11 55.93,78.82 arc-19 53.35,79.62 arc-32 51.78,81.06 arc55 49.46,82.46 arc-8 IC3.3
MISO  (1 unrouted)
  Bottom 0.61: ICSP.1 61.1,64.04 arc11 60.25,64.59 arc62 58.69,64.51 arc22 58.18,64 arc0 57.33,62.73 arc-56 56.4,62.22
MOSI
  Bottom 0.61: ICSP.4 56.27,59.72 arc299 IC3.17
N$1
  Bottom 0.61: R102.2 D7.A
N$2
  Bottom 0.61: C10.1 39.93,60.4 arc-65 41.5,60.69 arc-31 Q1.1 arc154 45.26,58.49 arc-53 46.11,61.58 arc35 46.66,62.81 arc-81 IC3.10
N$3
  Bottom 0.813: U$2.2 U$2.1 arc0 58.82,24.65 arc102 FERRITE-.1
N$4
  Bottom 0.61: JP102.1 IC3.23
N$5
  Bottom 0.61: R13.1 43.59,79.56 | 43.59,79.56 43.57,79.58 | C4.2 arc43 IC2.7 arc3 39.84,92.03 arc10 41.5,89.7 arc-57 42.68,87.41 arc10 42.64,84.66 arc15 42.02,82.75 arc45 42.36,81.16 arc-10 42.68,80.6 arc36 43.6,79.58 arc-173 43.59,79.55 arc-214 43.59,79.56
N$6
  Top 0.61: C2.1 arc-53 43.57,106.97 arc125 45.73,107.4 arc-41 46.24,108.08 arc-33 48.44,108.71 arc-13 52.04,108.29 arc-78 52.34,107.91 arc-8 IC1.6
  Bottom 0.61: R2.2 R1.1 arc-3 C2.1
N$7
  Bottom 0.61: D1.A R112.1
N$8
  Top 0.406: 3.62,70.32 arc-40 3.29,71.32 arc1 3.32,72.28 arc38 2.34,75.81 arc-39 1.6,76.69 arc2 1.48,80.82 | 1.57,91.73 arc6 1.5,94.68 arc-18 1.81,97.8
  Top 0.61: JP101.5 3.62,70.32 | 1.48,80.82 arc-4 1.57,91.73 | 1.81,97.8 arc-46 3.37,102.69 arc-50 8.43,103.17 arc38 12.71,103.17 arc85 13.59,104.8 arc-10 U$1.P$1
N$9  (1 unrouted)
  Top 0.61: 58.26,49.56 arc-9 58.09,47.4 arc-83 56.4,46 arc7 45.86,45.79 arc-74 44.21,46.85 arc-20 43.87,48.75
  Top 0.813: 58.26,49.56 arc-10 58.6,53.2 arc40 58.26,55.27 arc17 57.25,56.59 arc20 IC3.16
N$10
  Bottom 0.406: 45.52,96.98 arc58 45.31,95.63 arc-24 45.48,94.44 arc-4 45.26,92.37
  Bottom 0.61: 45.52,96.98 IC1.1 arc-147 47.38,98.68 arc60 47.89,97.57 arc22 49.2,96.98 arc66 50.39,97.4 arc44 50.73,98.63 arc-23 50.81,99.65 arc-27 51.36,100.62 arc-57 52.12,100.88 arc32 C3.2 | 45.26,92.37 arc4 45.09,90.8 arc36 45.56,88.89 arc-34 46.2,86.52 arc247 R11.1
N$11
  Top 0.61: R15.1 arc-216 38.62,79.92 arc68 39.25,80.21 arc-46 41.07,81.53 arc-2 C7.1
  Bottom 0.61: IC2.2 39.34,83.81 arc35 39.52,82.98 arc-48 39.82,82.05 arc-19 38.79,79.66 arc-45 R15.1 arc76 38.28,78.82 arc12 39.21,76.57 arc50 R16.2
N$12
  Top 0.61: JP102.2 60.46,75.05 arc41 59.62,75.3 arc-34 58.47,75.68 arc-35 58.05,76.15 arc58 56.36,77.38 arc-211 IC3.24
N$13
  Bottom 0.61: R100.1 26.92,31.69 arc-18 ST/SP.TIP
N$14
  Bottom 0.61: IC3.25 JP102.5
N$15
  Top 0.61: C3.1 arc-106 58.47,107.1 arc30 R3.1 arc-18 R4.2
  Bottom 0.61: IC1.2 49.63,100.83 arc-90 51.7,102.66 arc44 54.37,103.54 arc-8 56.7,105.28 arc51 C3.1
N$16
  Bottom 0.61: R103.1 2.55,30.87 arc-7 2.76,27.94 arc18 2.78,27.83 arc-85 CLK.TIP
N$17
  Bottom 0.61: R105.1 27.01,48.75 arc5 GATE_D.TIP
N$18
  Top 0.305: ICD.5 63.94,91.35 arc-95 64.19,91.56
  Top 0.406: 64.19,91.56 64.44,91.82 64.44,96.18 64.23,96.39 64.23,96.43 64.23,96.47
  Top 0.61: 64.23,96.43 arc6 R7.1
N$19  (via drill 0.6)
  Top 0.61: v52.42,70.22 arc73 52.12,71.66 arc-70 51.57,74.24 arc43 51.53,74.37 arc4 50.09,77.29 arc121 48.69,77.29 arc245 IC3.5
  Bottom 0.61: v52.42,70.22 arc53 51.62,67.93 arc-29 51.66,67.43 arc-11 51.66,56.5 arc81 54.28,53.79 arc-82 55.38,52.27 arc5 55.17,47.19 arc-67 52.93,43.76 arc-36 50.09,43.5 arc111 49.03,42.53 arc-26 IC4.5
N$20
  Bottom 0.61: IC3.26 JP102.7
N$21
  Bottom 0.61: R5.1 43.49,101.55 arc108 C2.2 arc-196 41.79,103.67 arc60 42.68,103.76 arc-96 45.14,104.39 arc16 46.15,103.5 arc50 49.41,104.69 arc99 IC1.7
N$22  (via drill 3.2 pad 6.45)  (1 unrouted)
  other vias: 39.49,53.85 4.49,53.89
N$23
  Bottom 0.61: U$2.11 44.37,24.79 arc58 43.35,25.02 arc-19 41.95,24.84 arc-1 42.54,24.79 arc-77 39.73,26.48 arc-8 39.25,29.18 arc-7 39.21,30.31 arc-249 D11.A
  Bottom 0.813: U$2.12 U$2.11
N$24
  Top 0.61: IC4.9 55.81,53.07 arc52 55.34,53.5 arc-31 54.79,53.84 arc0 52.67,56.08 arc-47 51.87,58.28 arc33 51.02,61.88 arc67 50.26,62.26 arc-11 IC3.11
N$25
  Bottom 0.61: FERRITE+.2 36.33,30.18 D10.A
N$26
  Bottom 0.61: D2.A 22.53,104.01 arc-12 R113.1
N$27
  Bottom 0.61: R110.1 GATE_A.TIP
N$28  (via drill 0.6)
  Top 0.305: ICD.1 61.86,89.7 arc-107 61.27,89.7
  Top 0.406: 61.27,89.7 arc-8 60.85,89.87 arc-58 v60.68,90.38
  Bottom 0.61: v60.68,90.38 arc29 C6.1 arc-321 59.07,95.16 arc20 57.08,91.52 L1.2
N$29
  Bottom 0.61: C11.1 Q1.2 46.36,65.99 arc-59 IC3.9
N$30
  Top 0.61: 51.28,54.17 arc5 51.66,51.68 arc-30 IC4.11
  Top 0.813: 51.28,54.17 arc1 50.98,56.67 arc24 50.39,58.37 arc34 48.91,59.68 arc40 IC3.12
N$31  (1 unrouted)
  Bottom 0.61: FERRITE+.1 43.88,26.38 arc-49 46.95,25.13 arc-2 U$2.9
  Bottom 0.813: U$2.9 arc-4 48.69,20.38
N$32
  Bottom 0.61: D3.A 15.85,96.41 arc22 R111.2
N$33
  Top 0.61: D8.A 23.68,36.53 arc-52 25.55,36.94 arc-17 27.71,36.08 arc-77 R101.2
N$34
  Top 0.61: R108.1 27.28,74.12 arc20 27.56,76.6 arc10 GATE_B.TIP
N$35  (via drill 0.6)
  Top 0.61: v52.72,72.8 arc-7 52.46,76.02 arc23 51.95,79.37 arc89 IC3.4
  Bottom 0.61: v52.72,72.8 arc-294 52.76,72.8 arc-66 52.12,71.49 arc45 50.73,69.67 arc5 50.73,59.76 arc-5 50.73,54.05 arc4 50.39,51.08 arc2 50.22,48.58 arc-10 50.01,47.1 arc-54 48.44,45.24 arc-20 46.96,44.9 arc57 44.04,43.12 arc49 IC4.3
N$36
  Bottom 0.61: R106.1 GATE_C.TIP
N$37
  Bottom 0.61: R109.2 16.01,79.45 arc-23 D4.A
N$38  (via drill 0.6)
  Top 0.61: v52.59,68.1 arc51 51.32,69.5 arc-98 50.77,70.86 arc7 50.64,72.51 arc32 50.01,74.41 arc64 48.86,75.05 arc106 IC3.6
  Bottom 0.61: v52.59,68.1 arc-44 52.72,59.59 arc93 54.83,58.66 arc-6 55.93,58.49 arc20 57.8,58.45 arc-117 58.26,57.9 arc24 58.18,57.14 arc8 58.64,54.43 arc-43 58.14,48.42 arc-6 56.91,46.43 arc15 55.81,45.07 arc-15 54.2,41.94 arc53 54.05,40.88 arc322 54.05,40.9 arc-235 IC4.7
N$39
  Top 0.61: MIDI.4 arc-2 17.86,6.35 arc-76 17.86,10.82 arc78 17.72,17.79 arc9 R20.1
N$41
  Bottom 0.61: IC3.21 59.03,68.78 arc-34 60.38,67.68 arc31 C8.1
N$42
  Bottom 0.61: R107.2 D5.A
N$44
  Bottom 0.61: D6.A R104.2
N$46
  Bottom 0.61: R19.1 OK1.7
N$56  (1 unrouted)
  Top 0.61: R18.2 59.58,46.13 arc-36 59.66,49.14 arc37 59.32,56.33 arc-28 58.18,57.94 arc9 58.31,60.69 arc-9 58.26,63.7 arc13 58.18,65.56 arc-27 58.31,67.09 arc37 58.31,70.14 arc-34 58.26,71.96 | IC3.2 arc-7 50.13,84.83 arc-63 52.38,82.54 arc-6 53.35,77.17 arc9 53.9,74.5 arc68 54.88,73.69 arc11 56.48,73.69 arc-23 57.63,73.57 arc-66 58.18,72.89 arc-13 58.18,72.08 arc86 58.31,71.92
  Bottom 0.61: R18.2 arc-63 61.01,42.42 arc65 61.01,39.76 arc-59 OK1.6
N$60
  Bottom 0.406: 44.04,89.06 arc-37 44.88,87.21 arc-2 44.92,86.73 arc0 44.95,86.22 arc0 44.99,85.53 arc19 45.14,84.86 arc-33 45.19,84.39 arc13 45.07,82.87 arc-16 45.08,82.75 arc15 44.96,82.82 arc-17 44.96,82.52 arc-13 44.91,82.23 arc12 44.87,81.95 arc-5 44.83,81.79 arc-6 44.65,81.38 arc64 45.07,80.4 R12.1
  Bottom 0.61: 44.04,89.06 arc-24 IC2.6 arc-114 C4.1 arc156 43.82,96.6 arc-53 R6.2
RESET  (1 unrouted)
  Bottom 0.406: 63.56,59.34 63.56,80.51
  Bottom 0.61: ICSP.5 62.33,58.12 63.56,59.34 | 63.56,80.51 arc11 63.43,81.82 arc38 62.96,82.63 arc23 62.29,83.01 arc14 58.43,83.73 arc3 55.68,83.81 arc-36 53.1,84.66 arc-36 52.08,86.06 arc94 48.78,87.58 | R8.2 53.05,89.36 arc-56 IC3.1
SCL_B
  Top 0.305: ICD.2 62.41,89.49 arc-65 61.99,89.19 arc39 60.89,88.39
  Top 0.406: 60.89,88.39 arc-23 60.72,88.3
  Top 0.61: 60.72,88.3 arc-81 R9.1
  Bottom 0.61: IC3.28 R9.1
SDA_T
  Top 0.305: ICD.3 62.91,89.27 62.88,89.23
  Top 0.406: 62.88,89.23 arc-24 61.61,88.01 arc4 60.04,85.8
  Top 0.61: 60.04,85.8 arc-117 R10.1
  Bottom 0.61: IC3.27 R10.1
START/STOP_COMP
  Top 0.61: IC4.15 arc13 41.63,44.28 arc21 42.11,43.06 arc-15 42.38,42.47 arc-19 42.5,41.51 arc8 42.54,40.22 arc57 43.34,39.03 arc23 44.26,38.76 arc-17 46.61,38.23 arc-38 48.72,36.47 arc289 JP2.10
START/STOP_CONT
  Bottom 0.61: JP100.9 14.84,37.36 arc-29 17.84,38.49 arc-12 19.16,38.49 arc16 23.83,38.66 arc-10 R100.2 arc1 R101.1
V+  (via drill 0.6)  (1 unrouted)
  Top 0.406: 40.27,95.46 arc-49 42,96.81 arc26 42.45,96.94 arc-29 43.33,97.54 arc-63 44.97,97.24
  Top 0.61: IC2.8 arc15 37.81,91.82 arc50 38.7,91.52 arc29 39.8,91.94 arc56 40.06,92.45 arc-9 40.14,93.85 arc-13 40.27,95.46 | 44.97,97.24 arc15 46.62,95.41 arc150 C5.1 | IC4.16 arc-3 38.53,45.66 arc-33 37.33,42.7 arc47 36.39,39.18 arc-22 D10.C arc50 37.94,34.17 arc105 41.3,34.81 C13.1 | v60.87,24.26 arc36 60.62,22.79 arc-5 60.86,20.55 arc-59 60.12,19.04 arc-40 58.94,18.75 arc14 54.34,18.66 arc-15 45.41,18.51 arc8 42.02,18.66 arc-12 37.8,18.98 arc-112 C16.+
  Bottom 0.406: 36.08,107.91 arc30 35.78,107.02 arc6 35.74,102.7 | 64.36,57.52 64.32,81.99 | 58.56,96.56 arc-56 57.33,98.12 arc-25 57.16,98.68 arc-57 59.02,99.92
  Bottom 0.61: 62.33,84.24 arc-43 63.81,83.22 63.89,83.09 64.23,82.33 64.28,82.37 64.32,81.99 | 43.87,108.12 arc117 42.55,109.39 arc-4 37.56,109.39 arc61 36.08,107.91 | 35.74,102.7 arc-1 35.65,94.95 arc7 IC2.8 | 63.39,56.76 63.64,56.76 64.36,57.52 | 60.25,96.01 arc53 58.81,96.52 arc-56 58.56,96.56 | 59.02,99.92 arc34 62.88,99.9 | C16.+ 37.55,24.25 arc-14 38.2,25.76 arc48 38.32,26.93 arc-1 37.85,28.4 arc-23 37.77,29.2 arc12 37.75,31.56 arc13 36.89,35.18 arc-19 36.38,37.95 arc256 D10.C | 63.67,46.41 arc23 62.97,44.01 arc-25 62.48,42.41 arc45 62.23,40.4 arc-20 62.36,39.11 arc18 62.42,38.31 arc-25 62.44,36.96 arc21 62.3,31.07 arc-14 62.42,27.8 arc-30 61.56,25.42 arc7 v60.87,24.26
  Bottom 0.813: 62.33,84.24 arc-56 61.78,87.45 arc-7 61.95,91.14 arc50 60.25,96.01 | 62.88,99.9 arc32 64.02,101.26 arc21 64.02,103.33 arc-10 63.89,105.87 arc21 63.56,108.08 arc77 61.99,109.05 arc-13 57.42,109.01 arc6 51.19,109.3 arc9 48.14,109.05 arc104 IC1.8 arc-153 47.21,107.02 arc65 C1.1 arc-143 43.87,108.12 | 63.67,46.41 arc42 63.96,48.86 arc-27 63.43,56.84
V-  (via drill 0.6)  (2 unrouted)
  Top 0.406: 37.77,83.64 arc91 35.55,81.45 arc1 35.55,75.61 arc-1 35.53,72.85 arc1 35.53,71.87 arc1 35.57,68.82 arc19 35.74,67.93 | 54.73,38.77 arc-21 54.76,38.3 arc11 54.93,37.18 arc47 55.76,35.58
  Top 0.61: 37.77,83.64 arc6 39.46,83.69 arc-7 42.55,83.73 arc122 IC2.4 arc-166 44.5,87.54 arc88 C5.2 arc90 46.62,90.5 | 42.42,57.11 arc-113 45.65,54.22 arc13 45.6,52.48 arc-97 44.08,50.87 arc48 42.51,50.24 arc-51 42.64,49.73 arc15 42.55,48.5 arc-8 42.55,47.74 arc43 44.08,44.95 arc48 44.67,44.65 arc5 53.77,44.64 arc-15 54.4,44.18 arc-62 55.16,43.46 arc-16 55.17,41.77 arc4 55.2,40.54 arc1 55.23,40.07 arc-55 54.93,39.39 arc65 54.73,38.77 | C1.2 44.84,101.98 arc-19 45.48,99.06 arc31 45.98,97.57 arc21 46.7,96.9 arc48 47.21,96.81 arc-87 48.02,96.3 arc33 49.07,95.25 arc16 v49.24,95.12 | 35.74,67.93 arc-41 35.74,67.89 | 55.76,35.58 arc2 57.68,33.9 | 57.68,33.9 arc6 60.65,31.87 arc-26 62.25,30.31 arc-28 62.33,30.04 arc-8 62.36,27.77 arc-15 FERRITE-.2 | C14.2 55.6,31.2 arc68 57.68,33.9 | 37.26,57.31 arc28 37.89,57.35 arc-11 38.48,57.49 arc0 39.37,57.6 arc-20 40.06,57.57 arc1 40.89,57.39 arc-14 41.62,57.14 arc49 42.46,57.12
  Top 0.813: 37.26,57.31 arc-85 36.29,58.58 arc17 35.74,67.89
  Bottom 0.61: IC1.4 53.01,97.32 arc-27 51.83,96.69 arc27 49.33,95.12 arc29 46.53,90.8 arc239 C5.2 | v49.24,95.12 arc-32 49.29,95.08 | 63.81,24.4 arc-48 63.93,25.99 arc-251 FERRITE-.2
  Bottom 0.813: C15.- 63.39,21.53 arc38 63.81,22.04 arc38 63.85,23.48 arc34 63.81,24.4

### Text on the board
bPlace: 1 | 1 | MIDI THING 0.22 | -12